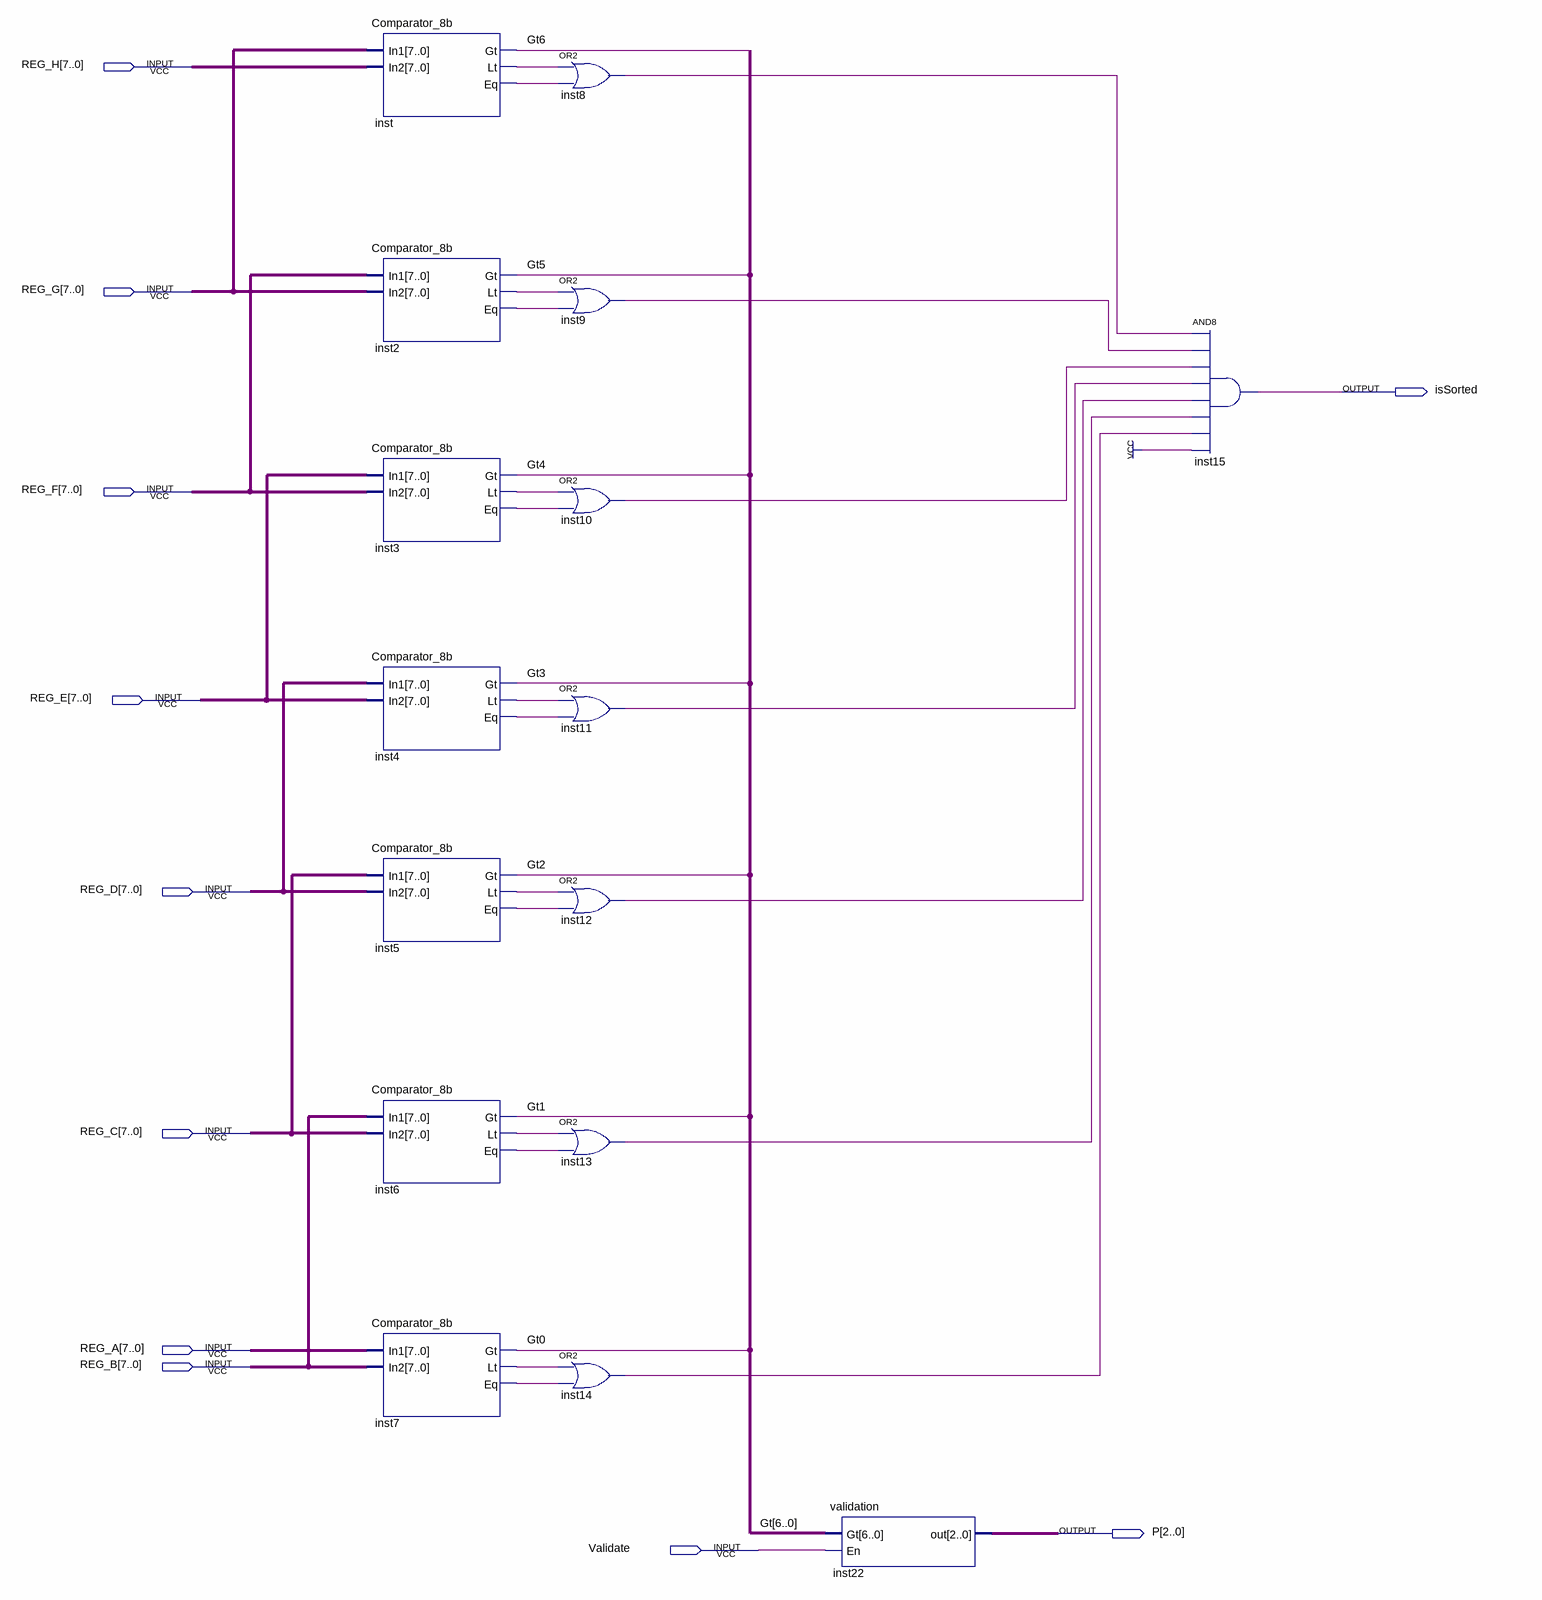
[diagram p0: schematic sheet]
// Quartus schematic Comparison_circuit.bdf as structural Verilog: 16 symbols, 11 pins
module Comparison_circuit (
  input  [7:0] REG_H,
  input  [7:0] REG_G,
  input  [7:0] REG_F,
  input  [7:0] REG_E,
  input  [7:0] REG_D,
  input  [7:0] REG_C,
  input  [7:0] REG_A,
  input  [7:0] REG_B,
  input  Validate,
  output isSorted,
  output [2:0] P
);

  wire inst2_eq, inst2_lt, inst3_eq, inst3_lt, inst4_eq, inst4_lt, inst5_eq, inst5_lt, inst6_eq, inst6_lt,
       inst7_eq, inst7_lt, inst8_out, inst9_out, inst10_out, inst11_out, inst12_out, inst13_out, inst14_out,
       inst_eq, inst_lt;
  wire [6:0] Gt;

  Comparator_8b inst (.In1(REG_G), .In2(REG_H), .Gt(Gt[6]), .Lt(inst_lt), .Eq(inst_eq));
  Comparator_8b inst2 (.In1(REG_F), .In2(REG_G), .Gt(Gt[5]), .Lt(inst2_lt), .Eq(inst2_eq));
  Comparator_8b inst3 (.In1(REG_E), .In2(REG_F), .Gt(Gt[4]), .Lt(inst3_lt), .Eq(inst3_eq));
  Comparator_8b inst4 (.In1(REG_D), .In2(REG_E), .Gt(Gt[3]), .Lt(inst4_lt), .Eq(inst4_eq));
  Comparator_8b inst5 (.In1(REG_C), .In2(REG_D), .Gt(Gt[2]), .Lt(inst5_lt), .Eq(inst5_eq));
  Comparator_8b inst6 (.In1(REG_B), .In2(REG_C), .Gt(Gt[1]), .Lt(inst6_lt), .Eq(inst6_eq));
  Comparator_8b inst7 (.In1(REG_A), .In2(REG_B), .Gt(Gt[0]), .Lt(inst7_lt), .Eq(inst7_eq));
  or inst8 (inst8_out, inst_lt, inst_eq);
  or inst9 (inst9_out, inst2_lt, inst2_eq);
  or inst10 (inst10_out, inst3_lt, inst3_eq);
  or inst11 (inst11_out, inst4_lt, inst4_eq);
  or inst12 (inst12_out, inst5_lt, inst5_eq);
  or inst13 (inst13_out, inst6_lt, inst6_eq);
  or inst14 (inst14_out, inst7_lt, inst7_eq);
  validation inst22 (.Gt(Gt), .En(Validate), .out(P));
  and inst15 (isSorted, inst8_out, inst9_out, inst10_out, inst11_out, inst12_out, inst13_out, inst14_out, 1'b1);
endmodule
